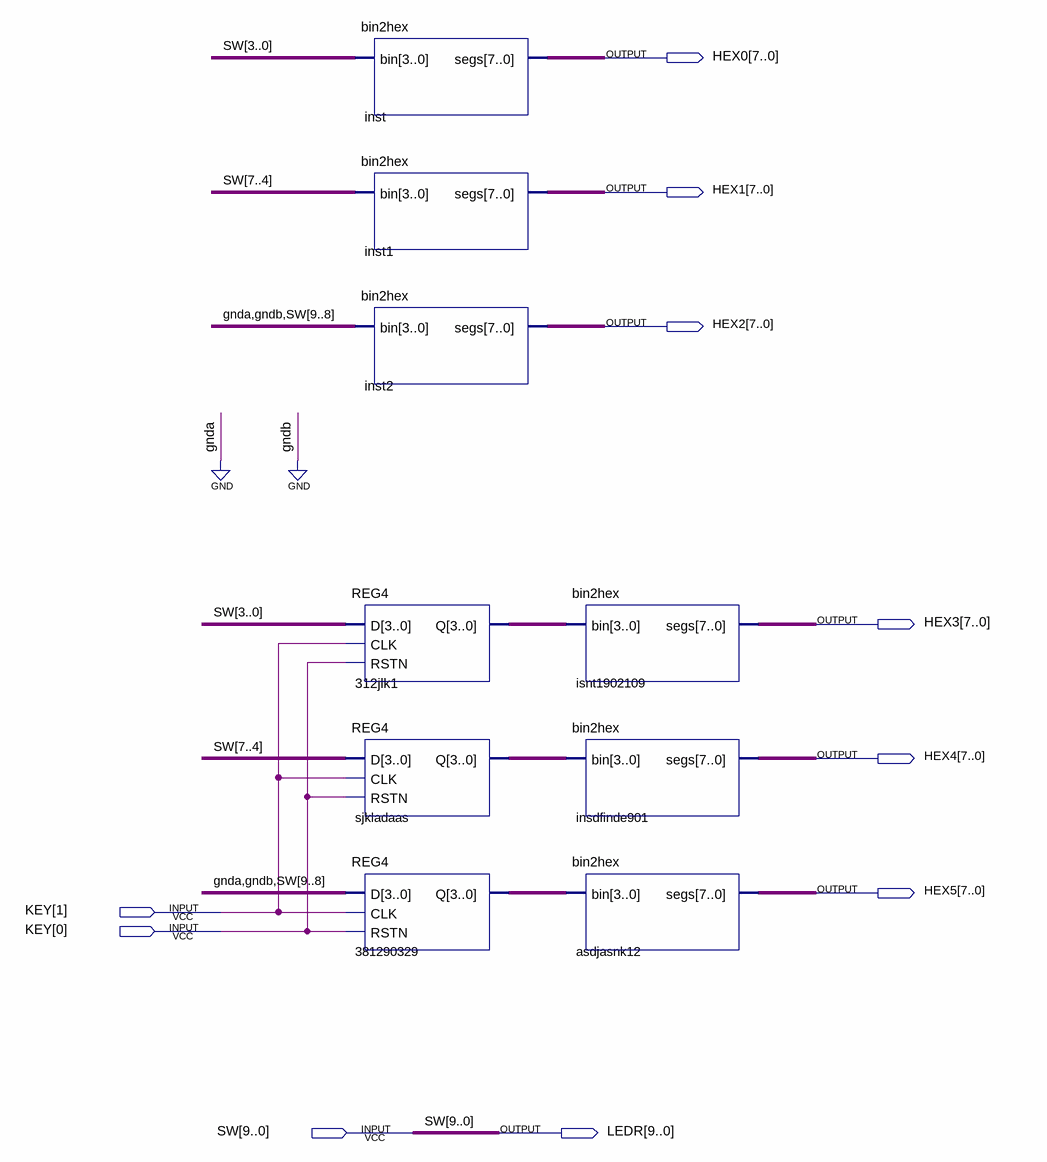
[diagram p0: schematic sheet]
// Quartus schematic lab4d.bdf as structural Verilog: 9 symbols, 10 pins
module lab4d (
  input  [1:0] KEY,
  input  [9:0] SW,
  output [7:0] HEX0,
  output [7:0] HEX1,
  output [7:0] HEX2,
  output [7:0] HEX3,
  output [7:0] HEX4,
  output [7:0] HEX5,
  output [9:0] LEDR
);

  wire [3:0] n312jlk1_q, n381290329_q, sjkladaas_q;

  bin2hex inst (.bin(SW[3:0]), .segs(HEX0));
  bin2hex inst1 (.bin(SW[7:4]), .segs(HEX1));
  bin2hex inst2 (.bin({2'b00, SW[9:8]}), .segs(HEX2));
  REG4 u_312jlk1 (.D(SW[3:0]), .CLK(KEY[1]), .RSTN(KEY[0]), .Q(n312jlk1_q));
  REG4 sjkladaas (.D(SW[7:4]), .CLK(KEY[1]), .RSTN(KEY[0]), .Q(sjkladaas_q));
  REG4 u_381290329 (.D({2'b00, SW[9:8]}), .CLK(KEY[1]), .RSTN(KEY[0]), .Q(n381290329_q));
  bin2hex isnt1902109 (.bin(n312jlk1_q), .segs(HEX3));
  bin2hex insdfinde901 (.bin(sjkladaas_q), .segs(HEX4));
  bin2hex asdjasnk12 (.bin(n381290329_q), .segs(HEX5));

  assign LEDR = SW;
endmodule
